# Altium schematic sheet [5] Motors.SchDoc
size A4; DocumentNumber: 5; SheetNumber: 5; SheetTotal: 5
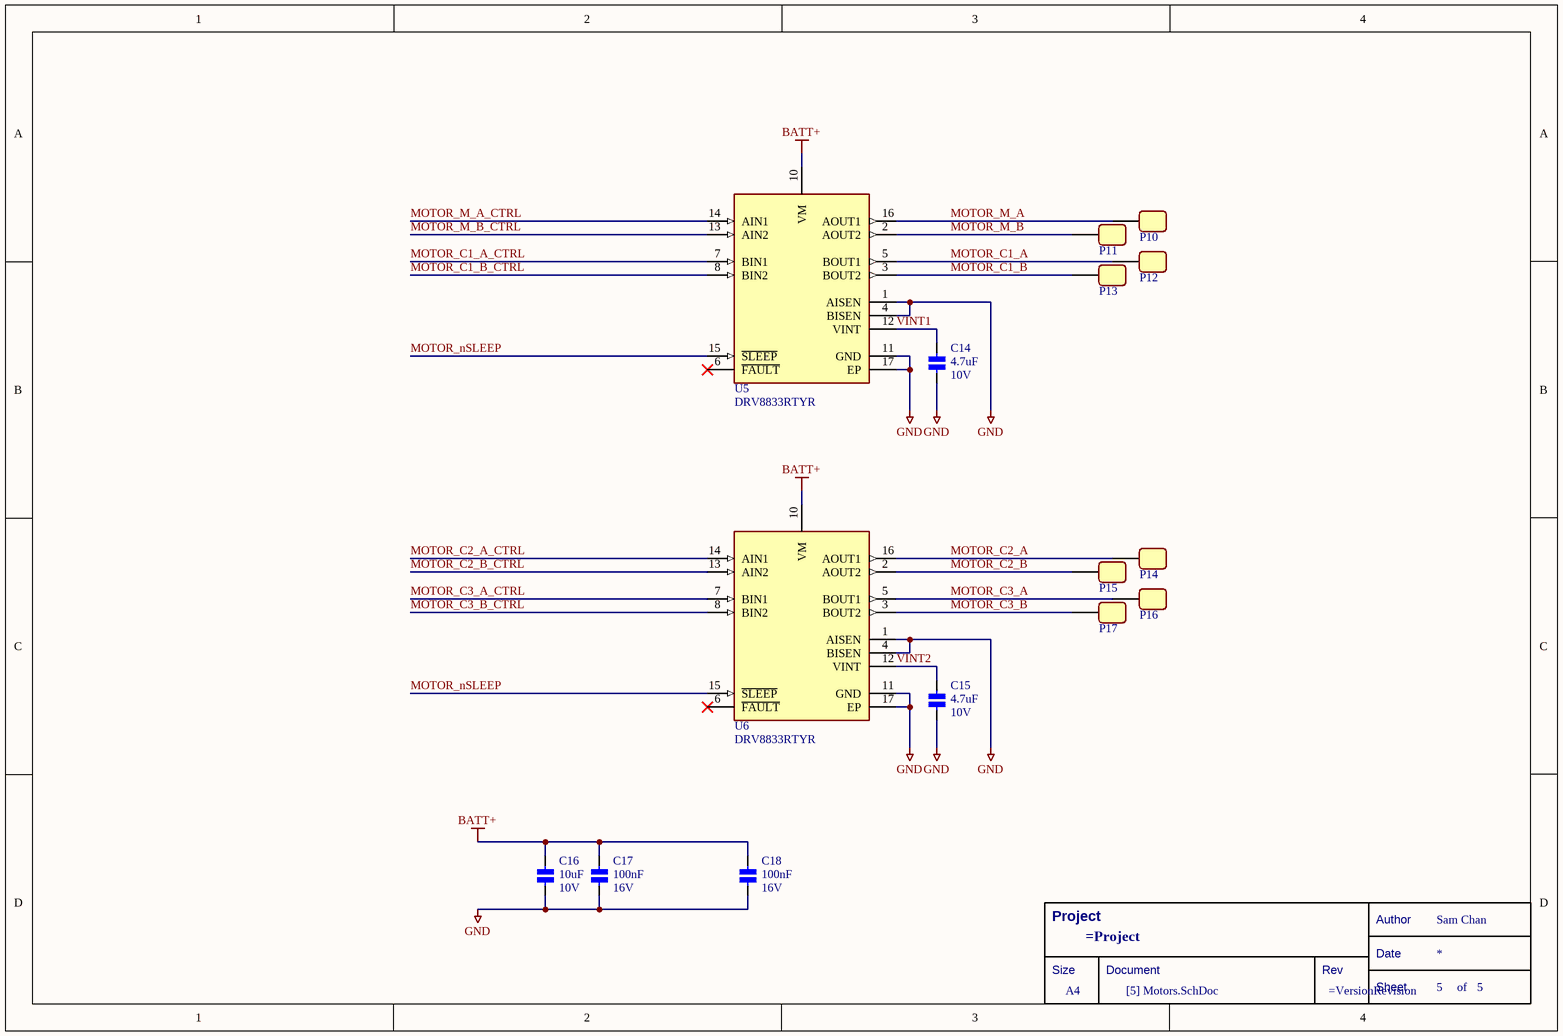
[diagram p0: [5] Motors.SchDoc]

## Parts
*  Title Block  (value not drawn)  (graphical)
C14  Voltage - Rated: 10V  [CAPC0402X05N]  (hidden comment: 4.7uF)
C15  Voltage - Rated: 10V  [CAPC0402X05N]  (hidden comment: 4.7uF)
C16  Voltage - Rated: 10V  [CAPC0402X05N]  (hidden comment: 10uF)
C17  Voltage - Rated: 16V  [CAPC0402X05N]  (hidden comment: 100nF)
C18  Voltage - Rated: 16V  [CAPC0402X05N]  (hidden comment: 100nF)
P10  PAD_4  [PAD_B2B]  (value not drawn)  (no BOM)
P11  PAD_4  [PAD_B2B]  (value not drawn)  (no BOM)
P12  PAD_4  [PAD_B2B]  (value not drawn)  (no BOM)
P13  PAD_4  [PAD_B2B]  (value not drawn)  (no BOM)
P14  PAD_4  [PAD_B2B]  (value not drawn)  (no BOM)
P15  PAD_4  [PAD_B2B]  (value not drawn)  (no BOM)
P16  PAD_4  [PAD_B2B]  (value not drawn)  (no BOM)
P17  PAD_4  [PAD_B2B]  (value not drawn)  (no BOM)
U5  DRV8833RTYR  [DRV8833CRTER]
U6  DRV8833RTYR  [DRV8833CRTER]

## Nets
BATT+: C16.1 C17.1 C18.1 U5.10(VM) U6.10(VM)
GND: C14.2 C15.2 C16.2 C17.2 C18.2 U5.1(AISEN) U5.4(BISEN) U5.11(GND) U5.17(EP) U6.1(AISEN) U6.4(BISEN) U6.11(GND) U6.17(EP)
MOTOR_C1_A: P12.1 U5.5(BOUT1)
MOTOR_C1_A_CTRL: U5.7(BIN1)
MOTOR_C1_B: P13.1 U5.3(BOUT2)
MOTOR_C1_B_CTRL: U5.8(BIN2)
MOTOR_C2_A: P14.1 U6.16(AOUT1)
MOTOR_C2_A_CTRL: U6.14(AIN1)
MOTOR_C2_B: P15.1 U6.2(AOUT2)
MOTOR_C2_B_CTRL: U6.13(AIN2)
MOTOR_C3_A: P16.1 U6.5(BOUT1)
MOTOR_C3_A_CTRL: U6.7(BIN1)
MOTOR_C3_B: P17.1 U6.3(BOUT2)
MOTOR_C3_B_CTRL: U6.8(BIN2)
MOTOR_M_A: P10.1 U5.16(AOUT1)
MOTOR_M_A_CTRL: U5.14(AIN1)
MOTOR_M_B: P11.1 U5.2(AOUT2)
MOTOR_M_B_CTRL: U5.13(AIN2)
MOTOR_nSLEEP: U5.15(~{SLEEP}) U6.15(~{SLEEP})
VINT1: C14.1 U5.12(VINT)
VINT2: C15.1 U6.12(VINT)

Not connected (* = marked no-connect by the designer): U5 6(~{FAULT})*; U6 6(~{FAULT})*

## Notes on the sheet
- (in symbol Title Block) Project; Author; Sam Chan; Date; Size; Document; Rev; A4; Sheet; of

## Library data of the parts
* = Title Block: Standard Title Block
C14 C15 = CER 4.7UF 10V: CAP CER 4.7UF 10V X5R 0402; Manufacturer: Samsung Electro-Mechanics; Manufacturer Part Number: CL05A475MP5NRNC; Category: Capacitors; Supplier 1: LCSC; Supplier Part Number 1: C23733; Package / Case: 0402; Capacitance: 4.7uF
C16 = CER 10UF 10V: CAP CER 10UF 10V X5R 0402; Manufacturer: Murata Electronics; Manufacturer Part Number: GRM155R61A106ME44D; Category: Capacitors; Supplier 1: LCSC; Supplier Part Number 1: C77000; Package / Case: 0402; Capacitance: 10uF
C17 C18 = CER 100NF 16V: CAP CER 0.1UF 16V X7R 0402; Manufacturer: Samsung Electro-Mechanics; Manufacturer Part Number: CL05B104KO5NNNC; Category: Capacitors; Supplier 1: LCSC; Supplier Part Number 1: C1525; Package / Case: 0402; Capacitance: 100nF
P10-P17 = PAD_4: a Pad for board to board connection
U5 U6 = DRV8833RTYR: IC MOTOR DRIVER; Manufacturer: Texas Instruments; Categories: Motor Drivers, Controllers; Case: 16-WQFN Exposed Pad; Manufacturer Part Number: DRV8833RTYR; Supplier 1: LCSC; Supplier Part Number 1: C154936